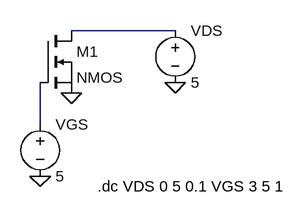
[diagram p0: schematic MOS_TRANS.asc]
MOS_TRANS.asc, the LTspice schematic file:
Version 4
SHEET 1 880 680
WIRE 336 144 176 144
WIRE 128 288 128 224
FLAG 336 224 0
FLAG 176 240 0
FLAG 128 368 0
SYMBOL nmos 128 144 R0
SYMATTR InstName M1
SYMBOL voltage 128 272 R0
WINDOW 123 0 0 Left 0
WINDOW 39 0 0 Left 0
SYMATTR InstName VGS
SYMATTR Value 5
SYMBOL voltage 336 128 R0
WINDOW 123 0 0 Left 0
WINDOW 39 0 0 Left 0
SYMATTR InstName VDS
SYMATTR Value 5
TEXT 216 384 Left 2 !.dc VDS 0 5 0.1 VGS 3 5 1

The netlist it stands for:
* MOS_TRANS.asc
M1 N001 N002 0 0 NMOS
VGS N002 0 5
VDS N001 0 5
.model NMOS NMOS
.model PMOS PMOS
.lib standard.mos
.dc VDS 0 5 0.1 VGS 3 5 1
.backanno
.end